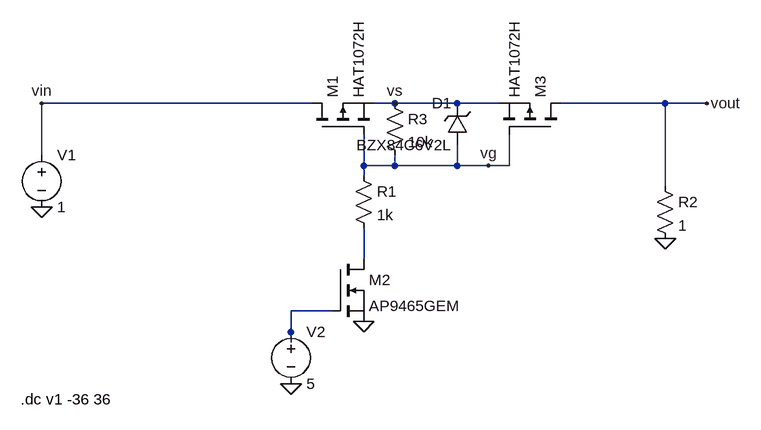
[diagram p0: schematic HighPowerReverseProtection.asc]
HighPowerReverseProtection.asc, the LTspice schematic file:
Version 4
SHEET 1 880 680
WIRE 64 64 -352 64
WIRE 192 64 160 64
WIRE 288 64 192 64
WIRE 352 64 288 64
WIRE 608 64 448 64
WIRE 672 64 608 64
WIRE -352 144 -352 64
WIRE 144 160 144 112
WIRE 192 160 192 144
WIRE 192 160 144 160
WIRE 288 160 288 128
WIRE 288 160 192 160
WIRE 336 160 288 160
WIRE 368 160 368 112
WIRE 368 160 336 160
WIRE 144 176 144 160
WIRE 608 192 608 64
WIRE 144 304 144 256
WIRE 96 384 32 384
WIRE 32 416 32 384
WIRE 32 432 32 416
FLAG 144 400 0
FLAG 608 272 0
FLAG 32 496 0
FLAG -352 224 0
FLAG -352 64 vin
FLAG 672 64 vout
FLAG 336 160 vg
FLAG 192 64 vs
SYMBOL pmos 64 112 R270
SYMATTR InstName M1
SYMATTR Value HAT1072H
SYMBOL res 128 160 R0
SYMATTR InstName R1
SYMATTR Value 1k
SYMBOL nmos 96 304 R0
SYMATTR InstName M2
SYMATTR Value AP9465GEM
SYMBOL res 592 176 R0
SYMATTR InstName R2
SYMATTR Value 1
SYMBOL zener 304 128 R180
WINDOW 0 24 64 Left 2
WINDOW 3 24 0 Left 2
SYMATTR InstName D1
SYMATTR Value BZX84C6V2L
SYMATTR Description Diode
SYMATTR Type diode
SYMBOL voltage -352 128 R0
WINDOW 123 0 0 Left 0
WINDOW 39 0 0 Left 0
SYMATTR InstName V1
SYMATTR Value 1
SYMBOL voltage 32 400 R0
WINDOW 123 0 0 Left 0
WINDOW 39 0 0 Left 0
SYMATTR InstName V2
SYMATTR Value 5
SYMBOL pmos 448 112 M270
SYMATTR InstName M3
SYMATTR Value HAT1072H
SYMBOL res 176 48 R0
SYMATTR InstName R3
SYMATTR Value 10k
TEXT -384 520 Left 2 !.dc v1 -36 36

The netlist it stands for:
* HighPowerReverseProtection.asc
M1 vin vg vs vs HAT1072H
R1 vg N001 1k
M2 N001 N002 0 0 AP9465GEM
R2 vout 0 1
D1 vg vs BZX84C6V2L
V1 vin 0 1
V2 N002 0 5
M3 vout vg vs vs HAT1072H
R3 vs vg 10k
.model D D
.lib standard.dio
.model NMOS NMOS
.model PMOS PMOS
.lib standard.mos
.dc v1 -36 36
.backanno
.end